# Altium schematic sheet TOP_TO_BOTTOM_CONT.SchDoc
size A; SheetNumber: 7; SheetTotal: 11
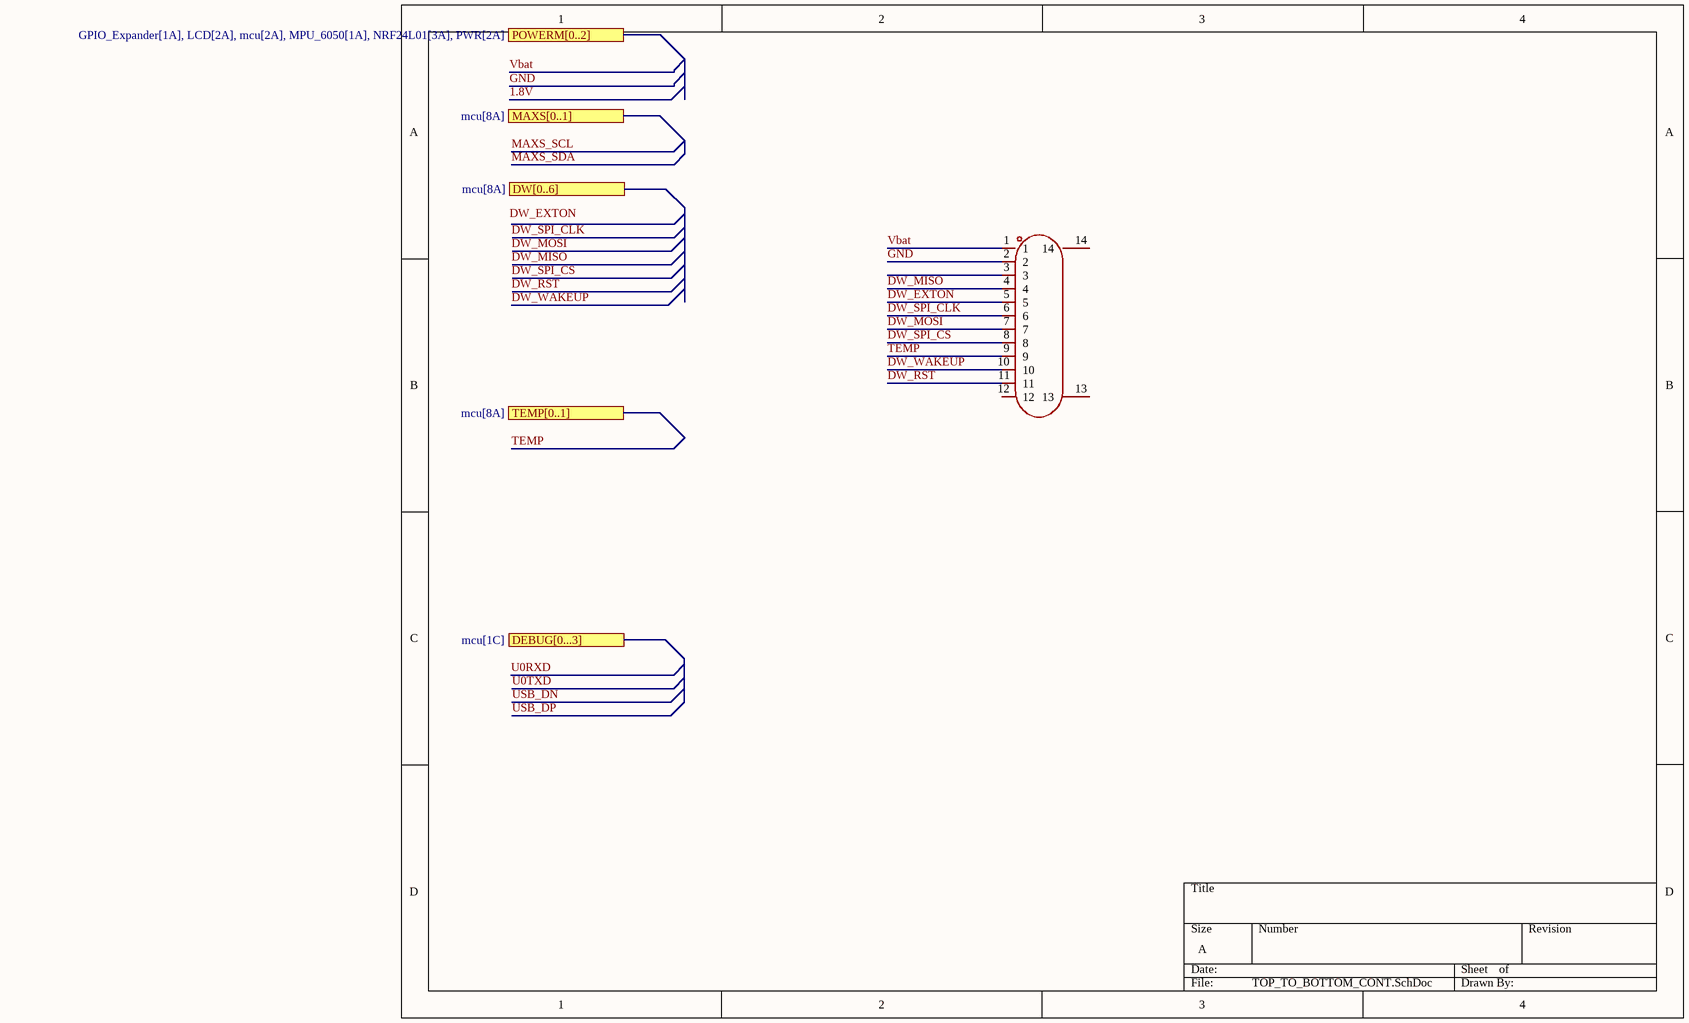
[diagram p0: TOP_TO_BOTTOM_CONT.SchDoc]

## Parts
FPC2  FH12-12S-0.5SH(55)  [FPC-SMD_FH12-12S-0.5SH-55]  (value not drawn)

## Ports
DEBUG[0...3] (see mcu[1C]), DW[0..6] (see mcu[8A]), MAXS[0..1] (see mcu[8A]), POWERM[0..2] (see GPIO_Expander[1A], LCD[2A], mcu[2A], MPU_6050[1A], NRF24L01[3A], PWR[2A]), TEMP[0..1] (see mcu[8A])

## Nets
DW_EXTON: FPC2.5
DW_MISO: FPC2.4
DW_MOSI: FPC2.7
DW_RST: FPC2.11
DW_SPI_CLK: FPC2.6
DW_SPI_CS: FPC2.8
DW_WAKEUP: FPC2.10
GND: FPC2.2
TEMP: FPC2.9
Vbat: FPC2.1

Not connected (* = marked no-connect by the designer): FPC2 3 12 13 14

## Notes on the sheet
- Labels drawn without touching a wire or pin: DW_EXTON, DW_MISO, DW_MOSI, DW_RST, DW_SPI_CLK, DW_SPI_CS

## Library data of the parts
FPC2 = FH12-12S-0.5SH(55): Manufacturer: HRS(Hirose); MFR.Part #: FH12-12S-0.5SH(55); JLCPCB Part #: C88360